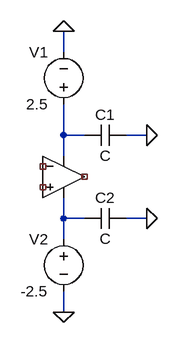
[diagram p0: schematic decoupling.asc]
decoupling.asc, the LTspice schematic file:
Version 4
SHEET 1 880 680
WIRE 208 -16 208 -48
WIRE 208 112 208 64
WIRE 240 112 208 112
WIRE 336 112 304 112
WIRE 208 144 208 112
WIRE 208 240 208 208
WIRE 240 240 208 240
WIRE 336 240 304 240
WIRE 208 272 208 240
WIRE 208 384 208 352
FLAG 208 384 0
FLAG 208 -48 0
FLAG 336 112 0
FLAG 336 240 0
SYMBOL voltage 208 80 R180
WINDOW 0 24 96 Left 2
WINDOW 3 24 16 Left 2
WINDOW 123 0 0 Left 0
WINDOW 39 0 0 Left 0
SYMATTR InstName V1
SYMATTR Value 2.5
SYMBOL voltage 208 256 M0
WINDOW 123 0 0 Left 0
WINDOW 39 0 0 Left 0
SYMATTR InstName V2
SYMATTR Value -2.5
SYMBOL OpAmps\\opamp2 208 112 R0
WINDOW 0 16 32 Invisible 2
WINDOW 3 16 96 Invisible 2
SYMATTR InstName U1
SYMBOL cap 304 96 R90
WINDOW 0 0 32 VBottom 2
WINDOW 3 32 32 VTop 2
SYMATTR InstName C1
SYMBOL cap 304 224 R90
WINDOW 0 0 32 VBottom 2
WINDOW 3 32 32 VTop 2
SYMATTR InstName C2

The netlist it stands for:
* decoupling.asc
V1 N001 0 2.5
V2 N002 0 -2.5
XU1 NC_01 NC_02 N001 N002 NC_03 opamp2  ; pins In+ In- V+ V- OUT
C1 0 N001 C
C2 0 N002 C
.backanno
.end